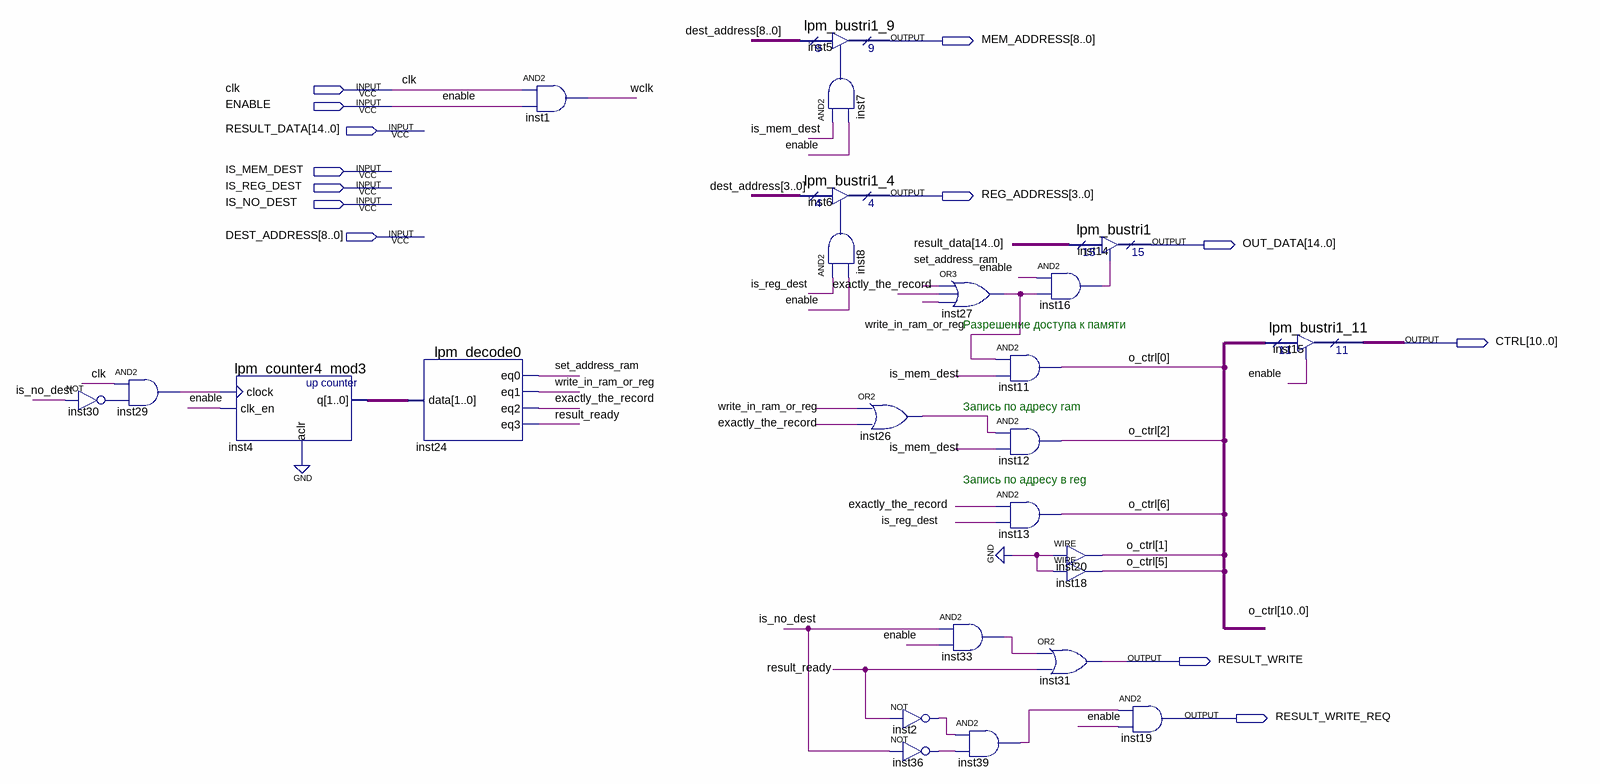
[diagram p0: schematic sheet]
// Quartus schematic RESULT_WRITER.bdf as structural Verilog: 25 symbols, 13 pins
module RESULT_WRITER (
  input  clk,
  input  ENABLE,
  input  [14:0] RESULT_DATA,
  input  IS_MEM_DEST,
  input  IS_REG_DEST,
  input  IS_NO_DEST,
  input  [8:0] DEST_ADDRESS,
  output [8:0] MEM_ADDRESS,
  output [3:0] REG_ADDRESS,
  output [14:0] OUT_DATA,
  output [10:0] CTRL,
  output RESULT_WRITE,
  output RESULT_WRITE_REQ
);

  wire exactly_the_record, inst2_out, inst7_out, inst8_out, inst16_out, inst26_out, inst27_out, inst29_out,
       inst30_out, inst33_out, inst36_out, inst39_out, result_ready, set_address_ram, wclk,
       write_in_ram_or_reg;
  wire [1:0] inst4_q;
  wire [10:0] o_ctrl;

  not inst30 (inst30_out, IS_NO_DEST);
  and inst29 (inst29_out, clk, inst30_out);
  lpm_counter4_mod3 inst4 (.clock(inst29_out), .clk_en(ENABLE), .aclr(1'b0), .q(inst4_q));
  lpm_decode0 inst24 (
    .data(inst4_q), .eq0(set_address_ram), .eq1(write_in_ram_or_reg), .eq2(exactly_the_record),
    .eq3(result_ready));
  and inst1 (wclk, clk, ENABLE);
  lpm_bustri1_9 inst5 (.enabledt(inst7_out), .data(DEST_ADDRESS), .tridata(MEM_ADDRESS));
  and inst7 (inst7_out, IS_MEM_DEST, ENABLE);
  lpm_bustri1_4 inst6 (.enabledt(inst8_out), .data(DEST_ADDRESS[3:0]), .tridata(REG_ADDRESS));
  and inst8 (inst8_out, IS_REG_DEST, ENABLE);
  or inst26 (inst26_out, write_in_ram_or_reg, exactly_the_record);
  or inst27 (inst27_out, set_address_ram, exactly_the_record, write_in_ram_or_reg);
  and inst33 (inst33_out, IS_NO_DEST, ENABLE);
  not inst2 (inst2_out, result_ready);
  not inst36 (inst36_out, IS_NO_DEST);
  and inst11 (o_ctrl[0], inst27_out, IS_MEM_DEST);
  and inst12 (o_ctrl[2], inst26_out, IS_MEM_DEST);
  and inst13 (o_ctrl[6], exactly_the_record, IS_REG_DEST);
  and inst39 (inst39_out, inst2_out, inst36_out);
  lpm_bustri1 inst14 (.enabledt(inst16_out), .data(RESULT_DATA), .tridata(OUT_DATA));
  and inst16 (inst16_out, ENABLE, inst27_out);
  assign o_ctrl[1] = 1'b0;  // WIRE inst20
  assign o_ctrl[5] = 1'b0;  // WIRE inst18
  or inst31 (RESULT_WRITE, inst33_out, result_ready);
  and inst19 (RESULT_WRITE_REQ, inst39_out, ENABLE);
  lpm_bustri1_11 inst15 (.enabledt(ENABLE), .data(o_ctrl), .tridata(CTRL));

  // Notes on the sheet:
  //   Разрешение доступа к памяти
  //   Запись по адресу ram
  //   Запись по адресу в reg
endmodule
